# EAGLE design Addon-mapleCUx_HM-RFM69-V10-005 (EAGLE 7.6.0)
MAPLE-CUx Large Version
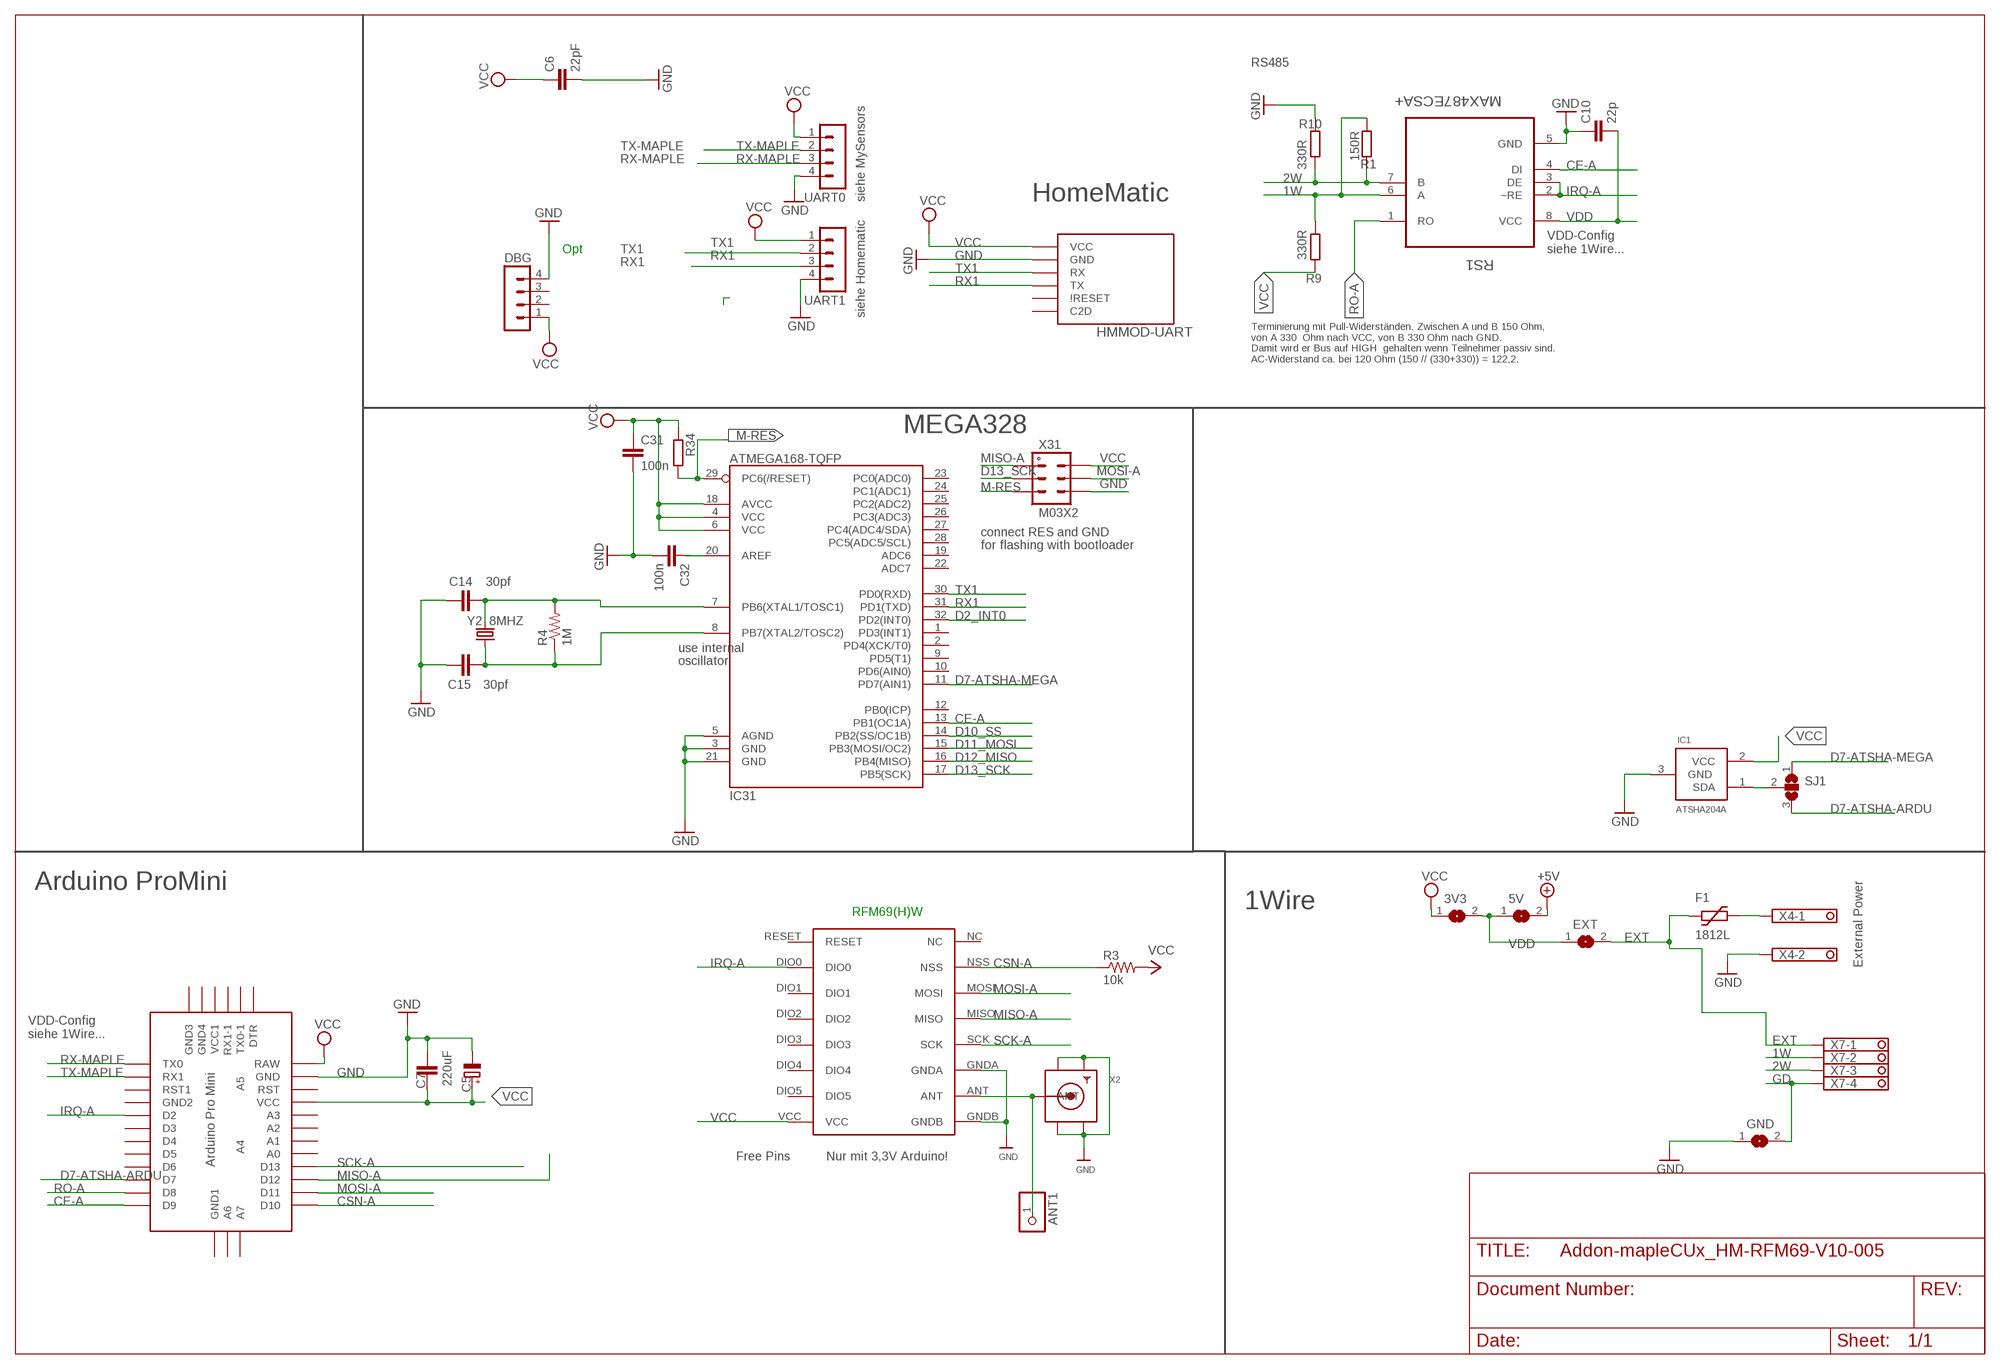
[diagram p0: schematic, sheet 1]

## Parts
3V3  SJ  [SJ]
5V  SJ  [SJ]
ANT1  PINHD-1X1  [1X01]
C5  220uF  CPOL-EUE5-8.5  [E5-8,5]
C6  22pF  C-EUC0805  [C0805]
C7  C-EUC1812  [C1812]
C10  22p  C-EUC0805  [C0805]
C14  30pf  CAP0805  [0805]
C15  30pf  CAP0805  [0805]
C31  100n  C-EUC0805  [C0805]
C32  100n  C-EUC0805  [C0805]
DBG  MA04-1  [MA04-1]
EXT  SJ  [SJ]
F1  1812L  [1812L]
GND  SJ  [SJ]
HMMOD-UART  HM-MOD-UARTDIL  [HM-MOD-UART-DIL]
IC1  ATSHA204A  [SOT23]
IC31  ATMEGA168-TQFP  [TQFP32-08]
R1  150R  R-EU_R0805  [R0805]
R3  10k  RESISTOR0805-RES  [0805]
R4  1M  RESISTOR0805-RES  [0805]
R9  330R  R-EU_R0805  [R0805]
R10  330R  R-EU_R0805  [R0805]
R34  R-EU_R0805  [R0805]
RFM69W  RFM69HW  [RFM]
RS1  MAX487ECSA+  [SOIC127P600X175-8N]
SJ1  SJ2W  [SJ_2]
U$2  ABK-PRO-MINI  [ABK-PRO-MINI]
UART0  MA04-1  [MA04-1]
UART1  MA04-1  [MA04-1]
X2  SMACONNECTOR_EDGE  [SMA_EDGELAUNCH]
X4  1751248  [1751248]
X7  1751264  [1751264]
X31  M03X2  [2X03-1.27MM_SMD]
Y2  8MHZ  CRYSTALTXC-7A  [CRYSTAL-TXC-7A]

## Nets
1W: R1.1 R9.2 RS1.6(A) X7.2
2W: R1.2 R10.1 RS1.7(B) X7.3
+5V [PWR]: 5V.2
CE-A: IC31.13(PB1(OC1A)) RS1.4(DI) U$2.D9
CSN-A: R3.1 RFM69W.NSS U$2.D10
D2_INT0: IC31.32(PD2(INT0))
D7-ATSHA-ARDU: SJ1.3 U$2.D7
D7-ATSHA-MEGA: IC31.11(PD7(AIN1)) SJ1.1
D10_SS: IC31.14(PB2(SS/OC1B))
D11_MOSI: IC31.15(PB3(MOSI/OC2))
D12_MISO: IC31.16(PB4(MISO))
D13_SCK: IC31.17(PB5(SCK)) X31.P$3
EXT [PWR]: EXT.2 F1.P$1 X7.1
GD [PWR]: GND.2 X7.4
GND [PWR]: C5.- C6.2 C7.1 C10.1 C14.1 C15.1 C31.2 C32.2 DBG.4 GND.1 HMMOD-UART.2(GND) IC1.3(GND) IC31.3(GND) IC31.5(AGND) IC31.21(GND) R10.2 RFM69W.GNDA RFM69W.GNDB RS1.5(GND) U$2.GND UART0.4 UART1.4 X2.GND@1(GND4) X2.GND@2(GND3) X2.GND@3(GND2) X2.GND@4(GND1) X4.2 X31.P$6
IRQ-A: RFM69W.DIO0 RS1.2(~RE) RS1.3(DE) U$2.D2
M-RES: IC31.29(PC6(/RESET)) R34.2 X31.P$5
MISO-A: RFM69W.MISO U$2.D12 X31.P$1
MOSI-A: RFM69W.MOSI U$2.D11 X31.P$4
N$1: ANT1.1 RFM69W.ANT X2.P(ANT)
N$3: C14.2 IC31.7(PB6(XTAL1/TOSC1)) R4.2 Y2.P$2
N$5: IC1.1(SDA) SJ1.2
N$13: C32.1 IC31.20(AREF)
N$19: C15.2 IC31.8(PB7(XTAL2/TOSC2)) R4.1 Y2.P$1
N$45 [PWR]: F1.P$2 X4.1
RO-A: RS1.1(RO) U$2.D8
RX1: HMMOD-UART.5(TX) IC31.31(PD1(TXD)) UART1.3
RX-MAPLE: U$2.TX0 UART0.3
SCK-A: RFM69W.SCK U$2.D13
TX1: HMMOD-UART.6(RX) IC31.30(PD0(RXD)) UART1.2
TX-MAPLE: U$2.RX1 UART0.2
VCC [PWR]: 3V3.1 C5.+ C6.1 C7.2 C31.1 DBG.1 HMMOD-UART.1(VCC) IC1.2(VCC) IC31.4(VCC) IC31.6(VCC) IC31.18(AVCC) R3.2 R9.1 R34.1 RFM69W.VCC U$2.RAW U$2.VCC UART0.1 UART1.1 X31.P$2
VDD [PWR]: 3V3.2 5V.1 C10.2 EXT.1 RS1.8(VCC)
Unconnected: DBG.2 DBG.3 HMMOD-UART.3(C2D) HMMOD-UART.4(\!RESET) IC31.1(PD3(INT1)) IC31.2(PD4(XCK/T0)) IC31.9(PD5(T1)) IC31.10(PD6(AIN0)) IC31.12(PB0(ICP)) IC31.19(ADC6) IC31.22(ADC7) IC31.23(PC0(ADC0)) IC31.24(PC1(ADC1)) IC31.25(PC2(ADC2)) IC31.26(PC3(ADC3)) IC31.27(PC4(ADC4/SDA)) IC31.28(PC5(ADC5/SCL)) RFM69W.DIO1 RFM69W.DIO2 RFM69W.DIO3 RFM69W.DIO4 RFM69W.DIO5 RFM69W.NC RFM69W.RESET U$2.A0 U$2.A1 U$2.A2 U$2.A3 U$2.A4 U$2.A5 U$2.A6 U$2.A7 U$2.D3 U$2.D4 U$2.D5 U$2.D6 U$2.DTR U$2.GND1(GND2) U$2.GND2(GND3) U$2.GND3(GND4) U$2.GND4(GND1) U$2.RST U$2.RST1 U$2.RX1-1 U$2.TX0-1 U$2.VCC1

## Notes on the sheet
- RS485
- siehe MySensors | HomeMatic
- Opt
- VDD-Config
  siehe 1Wire...
- siehe Homematic
- Terminierung mit Pull-Widerständen. Zwischen A und B 150 Ohm,
  von A 330  Ohm nach VCC, von B 330 Ohm nach GND. 
  Damit wird er Bus auf HIGH  gehalten wenn Teilnehmer passiv sind.
  AC-Widerstand ca. bei 120 Ohm (150 // (330+330)) = 122,2.
- MEGA328
- connect RES and GND
- for flashing with bootloader
- use internal
- oscillator
- Arduino ProMini
- 1Wire
- RFM69(H)W
- External Power
- VDD-Config
  siehe 1Wire...
- Free Pins | Nur mit 3,3V Arduino!

## Library data of the parts
3V3 5V EXT GND = jumper:SJ: SMD solder JUMPER
ANT1 = pinhead:PINHD-1X1: PIN HEADER
C5 = rcl:CPOL-EU: POLARIZED CAPACITOR, European symbol
C6 C7 C10 C31 C32 = rcl:C-EU: CAPACITOR, European symbol
C14 C15 = doug:CAP: Capacitor Standard 0603 ceramic capacitor, and 0.1" leaded capacitor.
DBG UART0 UART1 = con-lstb:MA04-1: PIN HEADER; OC_FARNELL: unknown; OC_NEWARK: unknown
F1 = ptc-littlefuse:1812L
HMMOD-UART = wireless:HM-MOD-UART: eQ3 HM-MOD-UART-AW-SH2 wireless module for 868 MHz. DIL version for mounting with pin header (antenna upwards) and SMD variant available (antenna downwards).
IC1 = Sensor:ATSHA204A
IC31 = atmel:ATMEGA168: Atmel Atmega 168/328/328P
R1 R9 R10 R34 = rcl:R-EU_: RESISTOR, European symbol
R3 R4 = doug:RESISTOR: Resistor Basic schematic elements and footprints for 0603, 1206, and PTH resistors.
RFM69W = hoperf:RFM69HW
RS1 = Maxim_By_element14_Batch_1:MAX487ECSA+: Low-Power, Slew-Rate-Limited RS-485/RS-422 Transceivers; MPN: MAX487ECSA+; OC_FARNELL: 9724532; OC_NEWARK: 68K4803; PACKAGE: SOIC-8; SUPPLIER: Maxim
SJ1 = jumper:SJ2W: SMD solder JUMPER
U$2 = Arduino-clone:ABK-PRO-MINI: ABK Pro-Mini Arduino Clone
X2 = adafruit:SMACONNECTOR: SMA Connector 90° DIP SMA Connector, 50 Ohm (4UConnector: 07259)
X4 = con-phoenix-350:1751248: MKDS 1/ 2-3,5 Printklemme Nennstrom: 10 A Bemessungsspannung: 160 V Raster: 3,5 mm Polzahl: 2 Montageart: Löten Anschlussart: Schraubanschluss Anschlussrichtung vom Leiter zur Platine: 0° Source: http://eshop.phoenixcontact.com .. 1751248.pdf; OC_FARNELL: unknown; OC_NEWARK: unknown
X7 = con-phoenix-350:1751264: MKDS 1/ 4-3,5 Printklemme Nennstrom: 10 A Bemessungsspannung: 160 V Raster: 3,5 mm Polzahl: 4 Montageart: Löten Anschlussart: Schraubanschluss Anschlussrichtung vom Leiter zur Platine: 0° Source: http://eshop.phoenixcontact.com .. 1751264.pdf; MPN: 1751264; OC_FARNELL: unknown; OC_NEWARK: 10R0934
X31 = mechanics:M03X2
Y2 = SparkFun-FreqCtrl:CRYSTAL: Various standard crystals. Proven footprints.

## Net classes
0 default: width 0.305 mm
1 PWR: width 0.457 mm

## Board
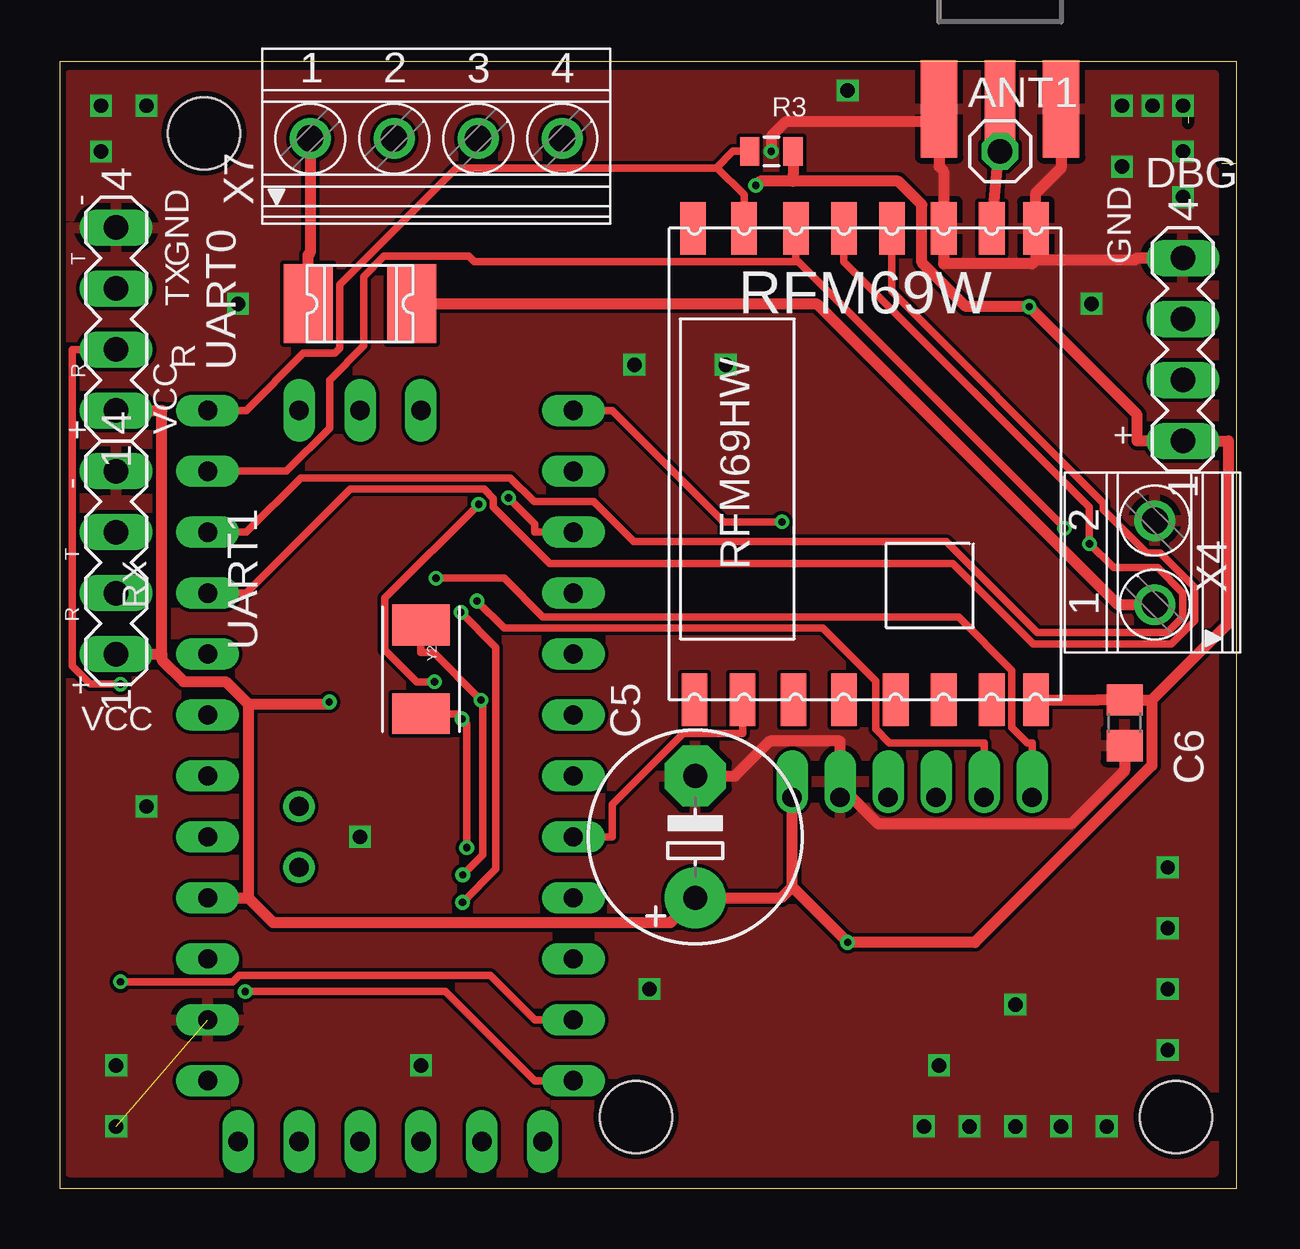
[diagram p1: board, top side]
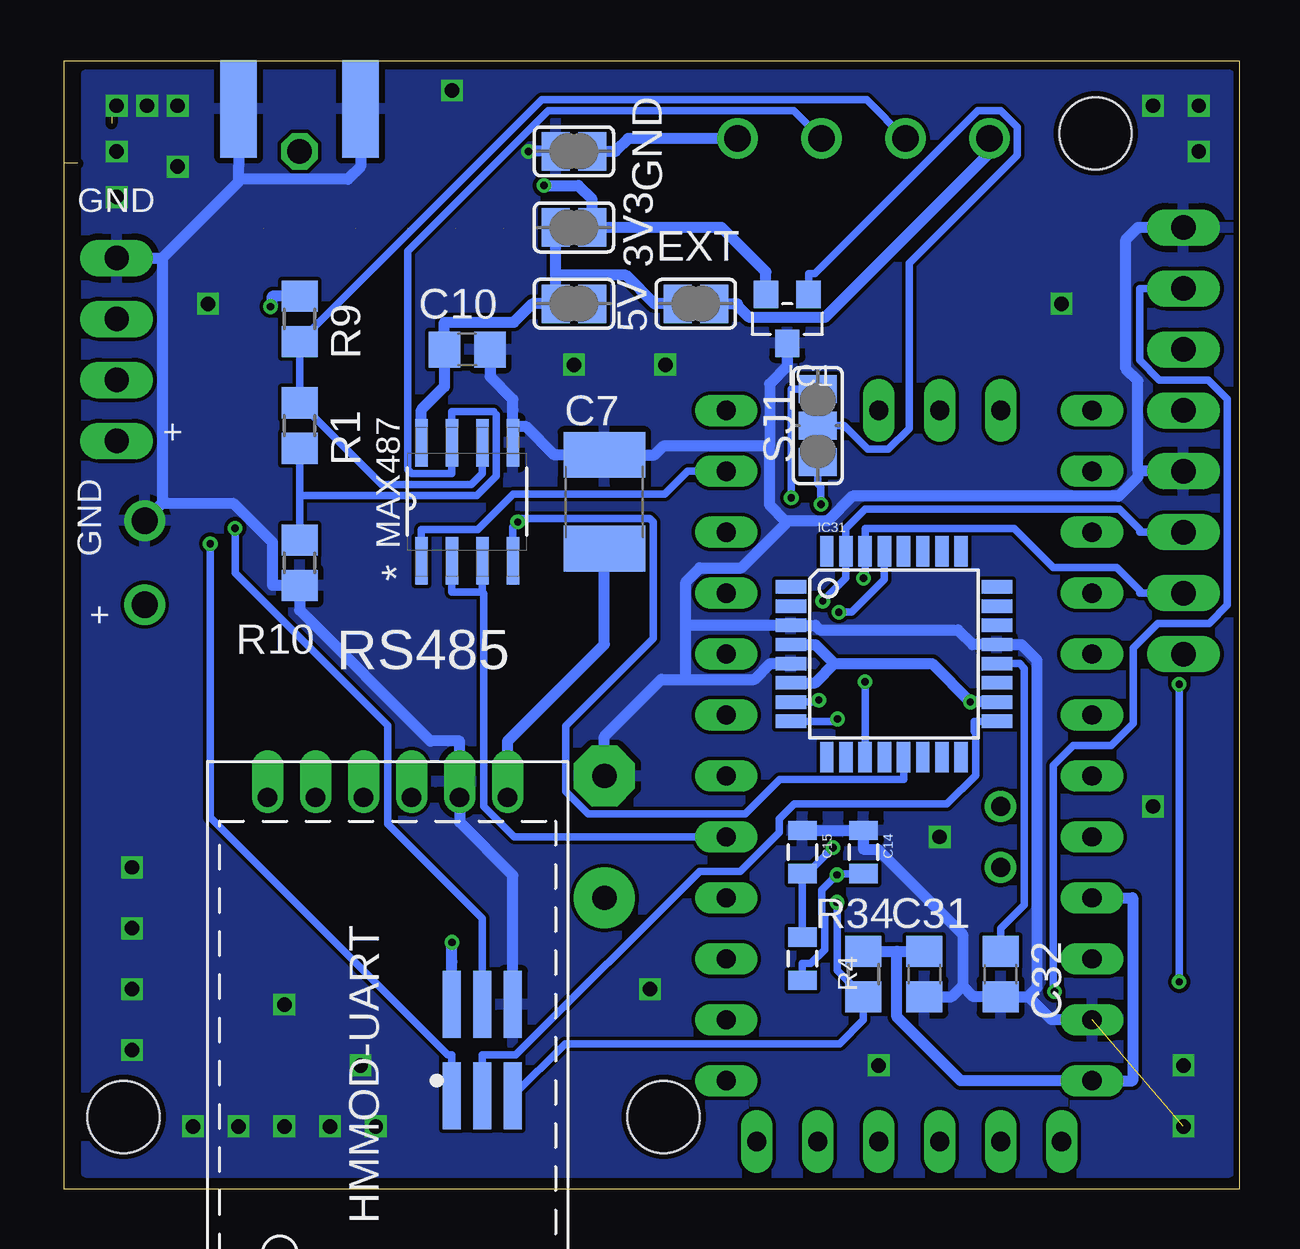
[diagram p2: board, bottom side, seen from below]

Size 49 x 47 mm. Coordinates in mm from the lower left corner, seen from the top.
Outline: 49,47 49,46.24
Outline: 47,44.7 47,44.41
Outline: 48.41,42.75 49,42.75
Outline: 49,47 0,47 0,0 49,0 49,42.75
Outline: 49,47 49,42.75
Copper layers (1*16): Top 0.035mm / dielectric 1.5mm / Bottom 0.035mm
Design rules "SeeedStudio_2layer_DRU_no_angle_20140221": minimum track width 6mil, minimum drill 12mil, track to track 6mil, track to pad 6mil, pad to pad 6mil, via to via 6mil, smd to smd 0mil, copper to edge 10mil, drill to drill 10mil, minimum pad ring 10mil, minimum via ring 6mil, stop-mask expansion 2mil, vias tented up to drill 100mil, thermal gap 10mil
Holes 3 mm at 6,44 24,3 46.5,3

### Footprints (pad centres in the part's own frame; a part is rotated, then mirrored left to right if it is on the bottom)
SJ = smd 1.168 x 1.6: 1 -0.762,0; 2 0.762,0
1X01 = drill 1.016 octagon: 1 0,0
E5-8,5 = drill 1.016 pad 2.54: + -2.54,0 | drill 1.016 pad 2.54 octagon: - 2.54,0
C0805 = smd 1.3 x 1.5: 1 -0.95,0; 2 0.95,0
C1812 = smd 1.9 x 3.4: 1 -1.95,0; 2 1.95,0
0805 = smd 0.8 x 1.2: 1 -0.9,0; 2 0.9,0
MA04-1 = drill 1.016 long: 1 -3.81,0; 2 -1.27,0; 3 1.27,0; 4 3.81,0
1812L = smd 2.03 x 3.3: P$1 -2.16,0; P$2 2.16,0
HM-MOD-UART-DIL = drill 0.8 offset: 1 0,12; 2 0,10; 3 0,8; 4 0,6; 5 0,4; 6 0,2
SOT23 = smd 1.016 x 1.143: 1 -0.889,-1.016; 2 0.889,-1.016; 3 0,1.016
TQFP32-08 = smd 1.27 x 0.559: 1 -4.293,2.8; 2 -4.293,2; 3 -4.293,1.2; 4 -4.293,0.4; 5 -4.293,-0.4; 6 -4.293,-1.2; 7 -4.293,-2; 8 -4.293,-2.8; 17 4.293,-2.8; 18 4.293,-2; 19 4.293,-1.2; 20 4.293,-0.4; 21 4.293,0.4; 22 4.293,1.2; 23 4.293,2; 24 4.293,2.8 | smd 0.559 x 1.27: 9 -2.8,-4.293; 10 -2,-4.293; 11 -1.2,-4.293; 12 -0.4,-4.293; 13 0.4,-4.293; 14 1.2,-4.293; 15 2,-4.293; 16 2.8,-4.293; 25 2.8,4.293; 26 2,4.293; 27 1.2,4.293; 28 0.4,4.293; 29 -0.4,4.293; 30 -1.2,4.293; 31 -2,4.293; 32 -2.8,4.293
R0805 = smd 1.3 x 1.5: 1 -0.95,0; 2 0.95,0
RFM = smd 2.184 x 1.067: ANT 19.651,2.889; DIO0 0,13.27; DIO1 0,11.143; DIO2 0,9.047; DIO3 0,6.889; DIO4 0,4.889; DIO5 0,2.889; GNDA 19.651,4.889; GNDB 19.651,1.048; MISO 19.651,9.047; MOSI 19.651,11.047; NC 19.651,15.334; NSS 19.651,13.206; RESET 0,15.27; SCK 19.651,7.048; VCC 0,1.048
SOIC127P600X175-8N = smd 1.981 x 0.533: 1 -2.464,1.905; 2 -2.464,0.635; 3 -2.464,-0.635; 4 -2.464,-1.905; 5 2.464,-1.905; 6 2.464,-0.635; 7 2.464,0.635; 8 2.464,1.905
SJ_2 = smd 1.168 x 1.6: 1 -1.524,0; 2 0,0; 3 1.524,0
ABK-PRO-MINI = drill 0.8 long: A0 10.16,-3.81; A1 10.16,-6.35; A2 10.16,-8.89; A3 10.16,-11.43; A6 3.81,-21.59; A7 6.35,-21.59; D2 -5.08,-3.81; D3 -5.08,-6.35; D4 -5.08,-8.89; D5 -5.08,-11.43; D6 -5.08,-13.97; D7 -5.08,-16.51; D8 -5.08,-19.05; D9 -5.08,-21.59; D10 10.16,-21.59; D11 10.16,-19.05; D12 10.16,-16.51; D13 10.16,-13.97; DTR 8.89,8.89; GND 10.16,3.81; GND1 -5.08,-1.27; GND2 -3.81,8.89; GND3 -1.27,8.89; GND4 1.27,-21.59; RAW 10.16,6.35; RST 10.16,1.27; RST1 -5.08,1.27; RX1 -5.08,3.81; RX1-1 3.81,8.89; TX0 -5.08,6.35; TX0-1 6.35,8.89; VCC 10.16,-1.27; VCC1 1.27,8.89 | drill 0.8: A4 6.35,-5.08; A5 6.35,-2.54
SMA_EDGELAUNCH = smd 4.064 x 1.524: GND@1 2.032,-2.54; GND@2 2.032,2.54 | smd 4.064 x 1.524 bottom: GND@3 2.032,2.54; GND@4 2.032,-2.54 | smd 4.064 x 1.27: P 2.032,0
1751248 = drill 1.1 pad 1.7: 1 -1.75,-0.1; 2 1.75,-0.1
1751264 = drill 1.1 pad 1.7: 1 -5.25,-0.1; 2 -1.75,-0.1; 3 1.75,-0.1; 4 5.25,-0.1
2X03-1.27MM_SMD = smd 0.75 x 2.8: P$1 -1.27,-1.905; P$2 -1.27,1.905; P$3 0,-1.905; P$4 0,1.905; P$5 1.27,-1.905; P$6 1.27,1.905
CRYSTAL-TXC-7A = smd 1.7 x 2.4: P$1 1.85,0; P$2 -1.85,0

### Placement (x,y rotation side)
3V3  27.74,40.07 180 bottom
5V  27.74,36.9 0 bottom
ANT1  39.17,43.24 0 top
C5  26.47,14.67 90 top
C6  44.36,19.43 270 top
C7  26.47,28.64 270 bottom
C10  32.19,34.99 180 bottom
C14  15.67,14.04 270 bottom
C15  18.22,14.04 270 bottom
C31  13.14,8.95 270 bottom
C32  9.96,8.95 270 bottom
DBG  46.79,34.99 90 top
EXT  22.66,36.9 0 bottom
F1  12.5,36.9 0 top
GND  27.74,43.24 0 bottom
HMMOD-UART  42.5,16.32 270 bottom
IC1  18.85,36.26 180 bottom
IC31  14.41,22.29 0 bottom
R1  39.17,31.81 270 bottom
R3  29.64,43.24 0 top
R4  18.22,9.59 270 bottom
R9  39.17,36.26 270 bottom
R10  39.17,26.1 270 bottom
R34  15.67,8.95 270 bottom
RFM69W  41.71,20.38 90 top
RS1  32.19,28.64 90 bottom
SJ1  17.58,31.81 90 bottom
U$2  16.31,10.86 180 top
UART0  2.34,36.26 90 top
UART1  2.34,26.1 90 top
X2  39.17,47.05 270 top
X4  45.52,26.1 90 top
X7  15.67,43.88 0 top
X31  31.55,5.78 0 bottom
Y2  15.04,21.66 270 top

### Tracks (layer width: path | path; a pad name or v marks a point on that pad's centre or on a via)
1W
  Bottom 0.305: RS1.6 31.55,29.81 32.01,29.35 35.76,29.35 R1.1 R9.2 29.08,45.4 15.54,45.4 X7.2
2W
  Bottom 0.305: 39.17,28.89 31.79,28.89 30.97,29.72 30.97,32.28 31.08,32.4 32.82,32.4 RS1.7 32.82,29.81 34.49,29.81 34.67,29.99 34.67,39.08 28.81,44.94 18.58,44.94 X7.3 | 39.17,28.89 39.17,29.91 R1.2 | R10.1 39.17,28.89
CE-A  (via drill 0.3 pad 0.61)
  Top 0.305: U$2.D9 23,32.45 27.66,27.8 v30.08,27.8
  Bottom 0.305: IC31.13 14,17.06 19.16,17.06 20.59,15.63 27.14,15.63 28.08,16.57 28.08,19.3 24.44,22.95 24.44,27.8 24.58,27.95 29.93,27.95 v30.08,27.8 30.28,27.6 RS1.4
CSN-A  (1 unrouted)
  Top 0.305: U$2.D10 7.76,32.45 10.14,34.83 11.45,34.83 11.66,35.04 11.66,37.69 16.52,42.54 27.33,42.54 27.37,42.57 | 27.37,42.57 28.04,43.24 R3.1 | 27.37,42.57 28.5,41.43 RFM69W.NSS
D7-ATSHA-ARDU  (via drill 0.3 pad 0.61)
  Top 0.305: v18.69,28.81 19.78,27.72 19.78,27.37 U$2.D7
  Bottom 0.305: v18.69,28.81 18.69,33.34 SJ1.3
D7-ATSHA-MEGA  (via drill 0.3 pad 0.61)
  Top 0.305: v17.44,28.53 13.53,24.62 13.53,22.45 14.85,21.13 v15.61,21.13
  Bottom 0.305: SJ1.1 17.58,29.4 17.44,29.27 v17.44,28.53 | IC31.11 v15.61,21.13
D13_SCK
  Bottom 0.305: IC31.17 11.05,19.49 11.05,19.06 10.99,19 10.99,17.24 12.2,16.04 18.55,16.04 19.18,15.41 19.18,14.86 20.8,13.24 22.51,13.24 30.16,5.58 31.55,5.58 X31.P$3
EXT
  Top 0.457: F1.P$1 10.34,38.93 10.42,39.01 X7.1
  Bottom 0.457: EXT.2 20.93,36.9 20.93,36.82 20.43,36.32 17.28,36.32 10.42,43.18 X7.1
GD
  Bottom 0.457: GND.2 26.01,43.24 25.48,43.78 X7.4
GND  (via drill 0.3 pad 0.61, 0.6)  (3 unrouted)
  Top 0.457: C6.2 44.36,17.44 42.15,15.23 34.08,15.23 32.5,16.8 | 32.5,16.8 32.5,18.66 29.58,18.66 28.12,17.21 C5.- | HMMOD-UART.2 32.5,16.8 | 36.63,44.47 30.23,44.47 29.64,43.88 v29.64,43.24 | 36.63,44.47 36.63,42.61 36.82,42.42 RFM69W.GNDA 36.82,38.56 40.51,38.56 40.66,38.72 | X2.GND@1 36.63,44.47 | 40.66,38.72 44.8,38.72 44.89,38.8 DBG.4 | 40.66,38.72 RFM69W.GNDB 40.66,41.51 41.71,42.56 X2.GND@2
  Bottom 0.457: 18.93,27.84 19.59,28.5 19.59,30.96 | 23.08,23.49 23.08,25.3 22.5,25.88 20.76,25.88 18.93,27.71 18.93,27.84 | 4.24,29.91 4.24,29.67 5.05,28.87 16.13,28.87 17.16,27.84 18.93,27.84 | 44.89,28.59 41.94,28.59 40.3,26.95 40.3,25.15 R10.2 39.17,24.12 33.72,18.66 32.5,18.66 HMMOD-UART.2 32.5,15.29 30.28,13.06 X31.P$6 | 23.08,21.24 23.08,23.49 | 23.08,21.24 24.09,21.24 26.47,18.86 C5.- | 23.08,21.24 20.21,21.24 19.56,21.89 IC31.5 | 23.08,23.49 IC31.3 17.68,23.49 17.49,23.3 11.74,23.3 11.13,22.69 IC31.21 9.1,22.69 8.44,22.03 8.44,8.39 8.81,8.02 | UART0.4 4.24,40.07 4.74,39.58 4.74,34.18 4.24,33.68 4.24,29.91 | UART1.4 4.24,29.91 | GND.1 29.47,43.24 29.48,43.24 v29.64,43.24 | 19.59,30.96 24.02,30.96 24.39,30.59 C7.1 28.55,30.59 29.75,31.79 30.28,31.79 | 19.59,30.96 19.59,33.55 18.85,34.29 IC1.3 | 30.28,31.79 30.28,32.48 30.28,32.9 31.23,33.86 C10.1 | RS1.5 30.28,31.79 | 44.89,28.59 X4.2 | 44.89,38.8 44.89,28.59 | C15.1 17.23,14.93 C14.1 15.67,14.15 15.09,14.15 11.55,10.61 11.55,8.46 | 41.71,42.08 41.71,42.61 X2.GND@2 | 41.71,42.08 37.16,42.08 36.63,42.61 X2.GND@1 | 41.71,42.08 41.71,41.98 44.89,38.8 | DBG.4 44.89,38.8 | 8.81,8.02 8.83,8 C32.2 11.09,8 11.55,8.46 | 8.81,8.02 7.84,7.05 U$2.GND | 11.55,8.46 12,8 C31.2
  other vias: 2.34,2.61 2.34,5.14 3.61,15.94 1.7,43.24 1.7,45.15 3.61,45.15 44.25,45.15 45.52,45.15 46.79,45.15 46.79,43.24 46.79,41.34 46.16,13.4 46.16,10.86 46.16,8.32 46.16,5.78 43.61,2.61 41.71,2.61 39.81,2.61 37.9,2.61 36,2.61 39.81,7.68 23.93,34.35 27.74,34.35 42.98,36.9 44.25,42.61 32.82,45.78 24.56,8.32 12.5,14.67 7.42,36.9 15.04,5.14 36.63,5.14
  pour Top: 0.44,0.7 0.44,46.42 48.06,46.42 48.06,0.7
  pour Bottom: 0.44,0.7 0.44,46.42 48.06,46.42 48.06,0.7
IRQ-A
  Top 0.305: RFM69W.DIO0 28.44,18.99 25.97,18.99 23,16.02 23,14.67 U$2.D2
  Bottom 0.305: U$2.D2 30.23,14.67 31.49,15.93 31.49,24.82 31.55,24.88 | 31.55,24.88 32.82,24.88 RS1.2 | RS1.3 31.55,24.88
M-RES  (via drill 0.3 pad 0.61)
  Top 0.305: v16.77,11.94 18.17,13.34 18.17,22.57 v16.7,24.04
  Bottom 0.305: v16.7,24.04 16.17,24.04 14.81,25.4 14.81,25.64 IC31.29 | v16.77,11.94 16.77,9.1 R34.2 15.67,7.53 15.67,7.05 16.67,6.05 28.1,6.05 X31.P$5
MISO-A  (via drill 0.3 pad 0.61)  (1 unrouted)
  Top 0.305: U$2.D12 7.76,27.37 10.02,29.63 18.77,29.63 19.76,28.64 22.23,28.64 23.9,26.97 36.94,26.97 40.72,23.19 46.13,23.19 46.78,23.85 46.78,24.84 45.73,25.89 43.9,25.89 v42.89,26.89 42.89,28.41 32.66,38.64 RFM69W.MISO
  Bottom 0.305: v42.89,26.89 42.89,15.48 32.99,5.58 32.82,5.58 X31.P$1
MOSI-A  (via drill 0.3 pad 0.61)  (1 unrouted)
  Top 0.305: v41.86,27.54 30.76,38.64 30.66,38.64 | 30.66,38.64 17.26,38.64 17.03,38.87 13.5,38.87 12.66,38.03 12.66,35.15 11.23,33.72 11.23,31.71 9.43,29.91 U$2.D11 | RFM69W.MOSI 30.66,38.64
  Bottom 0.305: X31.P$4 31.55,11.27 35.5,15.22 35.5,19.32 41.86,25.68 v41.86,27.54
N$1
  Top 0.305: X2.P 39.17,43.88 ANT1.1
  Top 0.457: RFM69W.ANT 39.17,43.88
N$3  (via drill 0.3 pad 0.61)
  Top 0.305: v16.78,13.09 17.61,13.92 17.61,20.3 v17.54,20.38 15.56,22.35 15.04,22.35 Y2.P$2
  Bottom 0.305: R4.2 18.22,9.39 17.86,9.39 17.29,9.96 17.29,11.35 17.41,11.47 17.41,12.46 v16.78,13.09 16.63,13.09 16.58,13.14 C14.2 | IC31.7 17.62,20.29 v17.54,20.38
N$5
  Bottom 0.305: IC1.1 17.96,38.15 17.71,38.15 10.91,44.95 9.95,44.95 9.27,44.26 9.27,43.08 13.77,38.58 13.77,31.7 14.64,30.84 15.5,30.84 16.47,31.81 SJ1.2
N$13
  Bottom 0.305: C32.1 9.96,10.86 8.97,11.85 8.97,21.69 9.17,21.89 IC31.20
N$19  (via drill 0.3 pad 0.61)
  Top 0.305: v16.95,14.22 16.95,19.39 v16.75,19.59 16.55,19.8 Y2.P$1
  Bottom 0.305: R4.1 18.22,11.2 C15.2 18.03,13.14 v16.95,14.22 | v16.75,19.59 16.85,19.49 IC31.8
N$45
  Top 0.457: X4.1 44.08,24.35 31.53,36.9 16.06,36.9 F1.P$2
RO-A
  Bottom 0.305: RS1.1 34.09,27.47 31.75,27.47 30.27,28.95 23.96,28.95 23,29.91 U$2.D8
RX1  (via drill 0.3 pad 0.61)
  Top 0.305: HMMOD-UART.5 38.5,18.59 34.56,18.59 33.98,19.17 33.98,21.17 31.78,23.37 18.5,23.37 v17.37,24.5
  Bottom 0.305: UART1.3 4.17,27.37 4.17,27.48 5.02,28.34 15.59,28.34 16.41,27.52 IC31.31 16.41,25.47 v17.37,24.5
RX-MAPLE  (via drill 0.3 pad 0.61)
  Top 0.305: v7.72,8.23 16.06,8.23 19.78,4.51 U$2.TX0
  Bottom 0.305: v7.72,8.23 7.76,8.27 7.76,17.65 6.93,18.48 5.34,18.48 4.42,19.4 4.42,22.54 3.41,23.56 1.28,23.56 0.51,24.33 0.51,32.92 1.31,33.72 3.35,33.72 4.17,34.54 4.17,37.53 UART0.3
SCK-A  (1 unrouted)
  Top 0.305: RFM69W.SCK 34.66,37.41 43.48,28.59 43.48,28.31 45.28,26.51 45.83,26.51 47.28,25.06 47.28,23.7 46.29,22.71 40.55,22.71 37.2,26.06 20.41,26.06 18.06,28.42 18.06,28.78 17.67,29.17 12.1,29.17 7.76,24.83 U$2.D13
TX1  (via drill 0.3 pad 0.61)
  Top 0.305: v15.67,25.45 18.5,25.45 20.12,23.83 37.44,23.83 39.66,21.61 39.66,19.23 40.31,18.59 40.5,18.59 HMMOD-UART.6
  Bottom 0.305: UART1.2 4.17,24.83 4.17,24.94 5.12,25.9 7.77,25.9 9.39,27.52 15.61,27.52 IC31.30 15.61,25.64 15.67,25.58 v15.67,25.45
TX-MAPLE  (via drill 0.3 pad 0.61)
  Top 0.305: UART0.2 0.51,34.99 0.51,21.79 1.27,21.04 v2.52,21.04 | v2.52,8.63 7.2,8.63 7.46,8.89 17.94,8.89 19.78,7.05 U$2.RX1
  Bottom 0.305: v2.52,21.04 v2.52,8.63
VCC  (via drill 0.3 pad 0.61)
  Top 0.457: 4.24,22.29 4.24,22.05 5.15,21.15 6.9,21.15 7.84,20.21 | 7.84,20.21 7.84,12.13 | 7.84,12.13 | 7.84,20.21 11.13,20.21 v11.22,20.3 | 7.84,12.13 8.88,11.09 25.43,11.09 C5.+ 30.05,12.13 30.5,12.59 | U$2.VCC 7.84,12.13 | 30.55,41.99 29.16,41.99 v28.99,41.82 | 30.55,41.99 34.93,41.99 35.91,41.02 35.91,38.62 37.75,36.77 v40.38,36.77 44.89,32.27 44.89,31.18 DBG.1 48.69,31.18 48.69,23.58 45.49,20.38 | 30.55,41.99 30.55,42.26 R3.2 | 30.5,12.59 HMMOD-UART.1 | 30.5,12.59 v32.82,10.27 38.12,10.27 45.49,17.64 45.49,20.38 | 45.49,20.38 C6.1 43.23,20.38 43.22,20.38 RFM69W.VCC | UART0.1 4.24,32.45 4.24,22.29 | UART1.1 4.24,22.29
  Bottom 0.457: U$2.VCC 4.46,12.13 4.46,4.51 U$2.RAW 11.63,4.51 14.28,7.16 14.28,9.91 | v28.99,41.82 27.55,41.82 26.98,41.25 3V3.1 21.58,40.07 19.74,38.23 IC1.2 | 16.88,21.89 12.81,21.89 v11.22,20.3 11.14,20.3 11.13,20.29 IC31.18 | 16.88,21.89 17.68,21.09 IC31.6 | 16.88,21.89 17.68,22.69 IC31.4 | v32.82,10.27 32.82,9.47 X31.P$2 | R9.1 40.3,37.21 40.3,36.86 v40.38,36.77 | C7.2 26.47,22.7 30.5,18.66 HMMOD-UART.1 | 14.28,9.91 C31.1 | 14.28,9.91 15.11,9.91 R34.1
VDD
  Bottom 0.457: 28.5,38.08 3V3.2 | 28.5,38.08 28.5,37.49 5V.1 29.47,36.9 30.24,36.12 33.14,36.12 C10.2 33.14,34.82 33.14,34.01 33.14,33.43 34.09,32.48 RS1.8 | EXT.1 24.39,36.9 25.57,38.08 28.5,38.08

### Text on the board
tNames: GND | - | T | GND | TX | R | R | + | VCC | + | - | T | R | RX | + | VCC
bNames: GND | MAX487 | + | GND | + | RS485